# EAGLE schematic OmniMotiv-v1 (EAGLE 5.10)
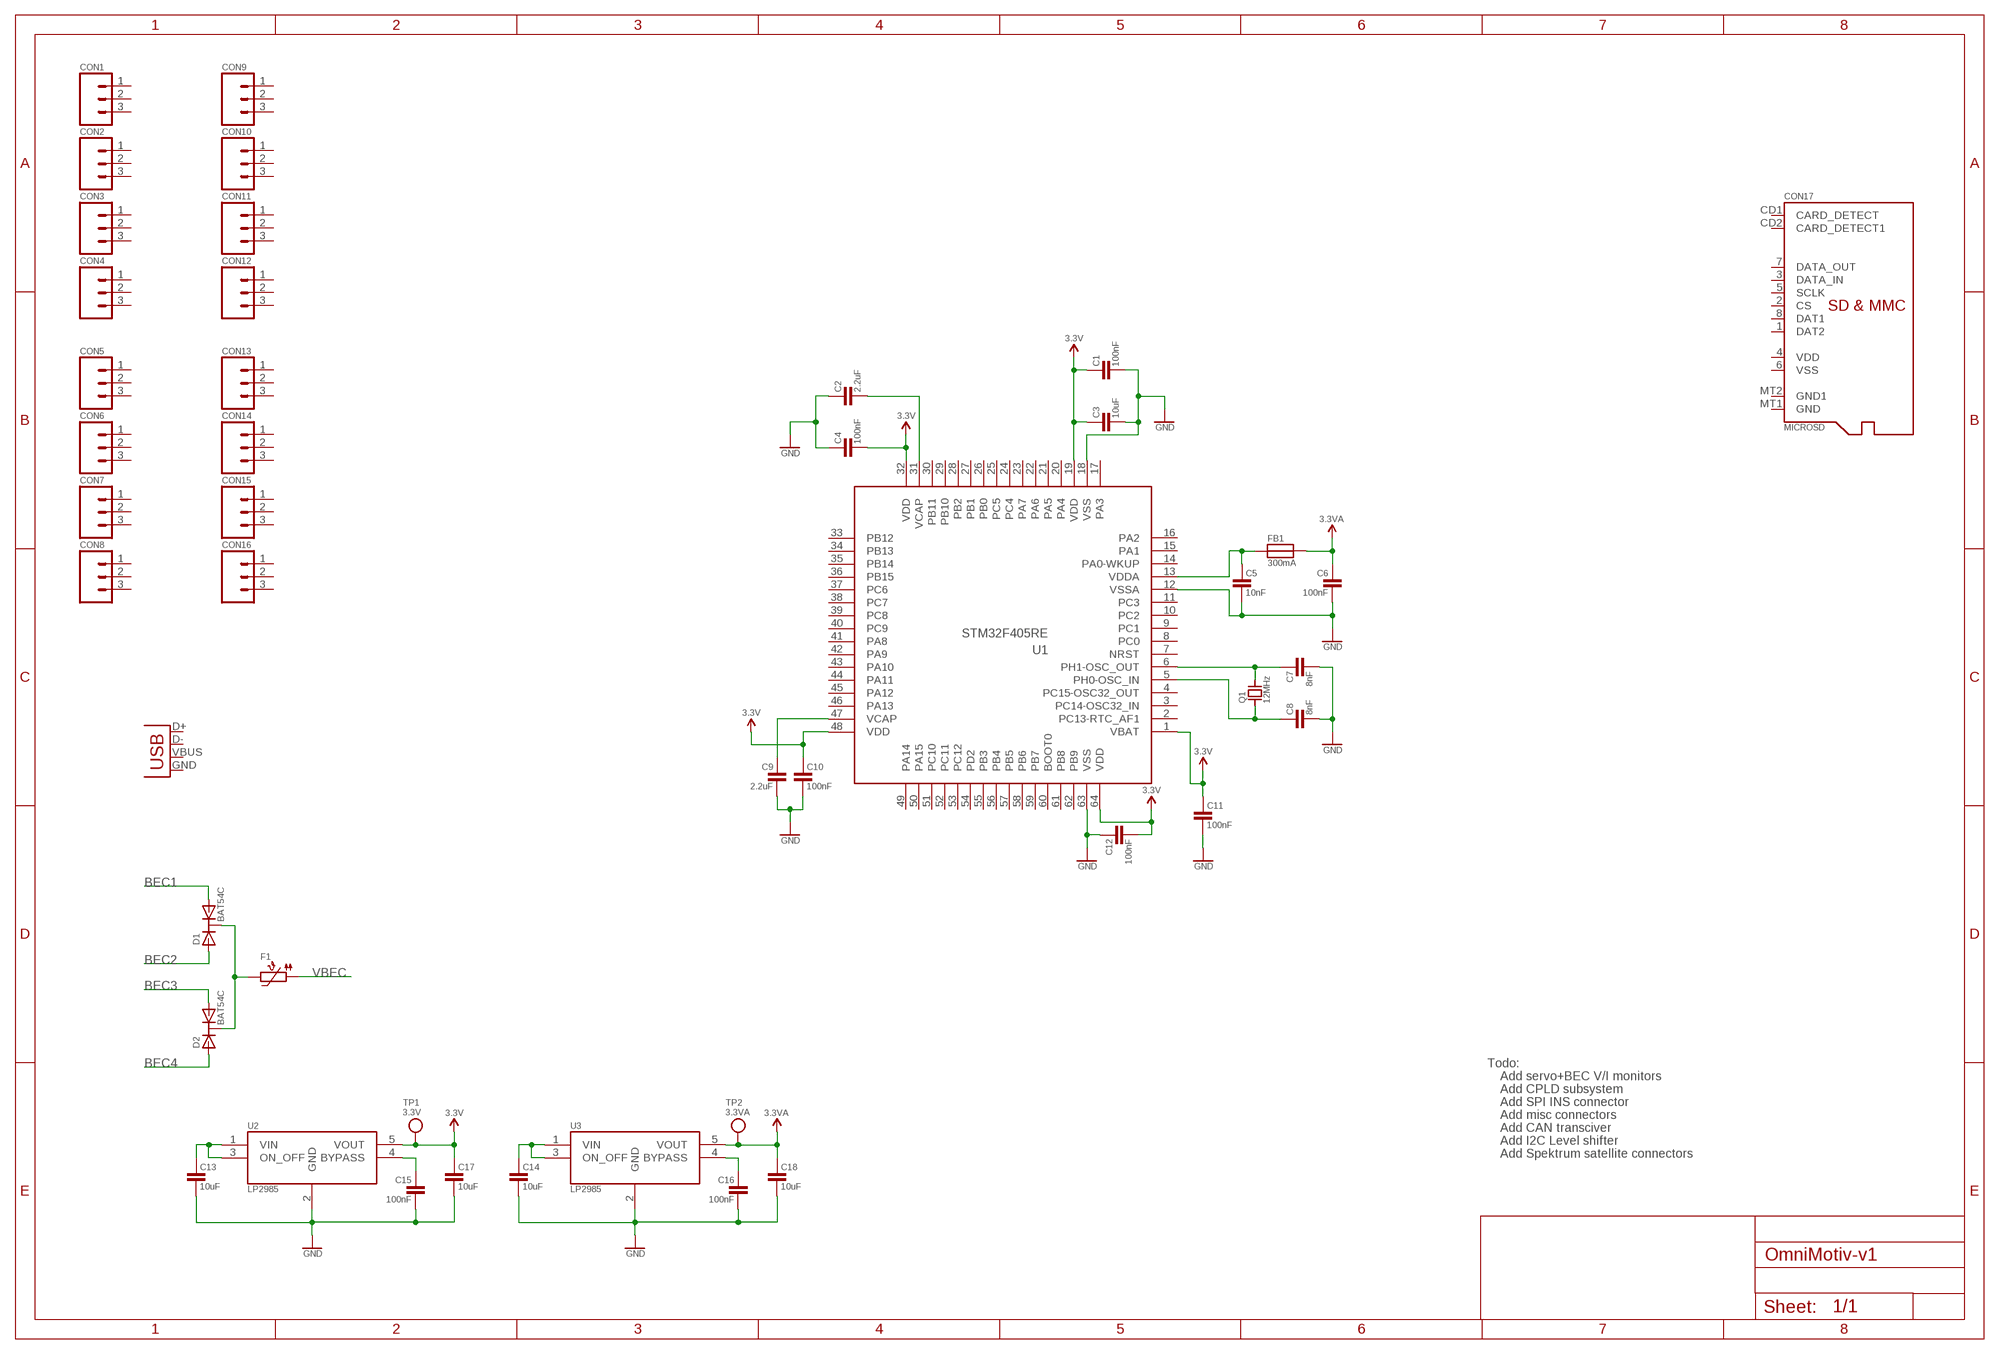
[diagram p0: schematic, sheet 1]

## Parts
C1  100nF  CAPACITOR-CERAMIC0402  [0402-CAP]
C2  2.2uF  CAPACITOR-CERAMIC0603  [0603]
C3  10uF  CAPACITOR-CERAMIC0805  [0805]
C4  100nF  CAPACITOR-CERAMIC0402  [0402-CAP]
C5  10nF  CAPACITOR-CERAMIC0402  [0402-CAP]
C6  100nF  CAPACITOR-CERAMIC0402  [0402-CAP]
C7  8nF  CAPACITOR-CERAMIC0402  [0402-CAP]
C8  8nF  CAPACITOR-CERAMIC0402  [0402-CAP]
C9  2.2uF  CAPACITOR-CERAMIC0603  [0603]
C10  100nF  CAPACITOR-CERAMIC0402  [0402-CAP]
C11  100nF  CAPACITOR-CERAMIC0402  [0402-CAP]
C12  100nF  CAPACITOR-CERAMIC0402  [0402-CAP]
C13  10uF  CAPACITOR-CERAMIC0805  [0805]
C14  10uF  CAPACITOR-CERAMIC0805  [0805]
C15  100nF  CAPACITOR-CERAMIC0402  [0402-CAP]
C16  100nF  CAPACITOR-CERAMIC0402  [0402-CAP]
C17  10uF  CAPACITOR-CERAMIC0805  [0805]
C18  10uF  CAPACITOR-CERAMIC0805  [0805]
CON1  M03PTH  [1X03]
CON2  M03PTH  [1X03]
CON3  M03PTH  [1X03]
CON4  M03PTH  [1X03]
CON5  M03PTH  [1X03]
CON6  M03PTH  [1X03]
CON7  M03PTH  [1X03]
CON8  M03PTH  [1X03]
CON9  M03PTH  [1X03]
CON10  M03PTH  [1X03]
CON11  M03PTH  [1X03]
CON12  M03PTH  [1X03]
CON13  M03PTH  [1X03]
CON14  M03PTH  [1X03]
CON15  M03PTH  [1X03]
CON16  M03PTH  [1X03]
CON17  MICROSD  [MICROSD]
D1  BAT54C  [SOT23]
D2  BAT54C  [SOT23]
F1  PTC1812  [1812]
FB1  300mA  FERRITE0603  [0603]
Q1  12MHz  CRYSTAL5X3-2  [CRYSTAL-5X3-2]
TP1  3.3V  TESTPOINTROUND1MM  [TESTPOINT_ROUND_1MM]
TP2  3.3VA  TESTPOINTROUND1MM  [TESTPOINT_ROUND_1MM]
U1  STM32F405RE  STM32F205RE  [LQFP64]
U2  LP2985  [SOT-23-5]
U3  LP2985  [SOT-23-5]
USB1  USBMICRO-B  [USB-MICRO-B]

## Nets
3.3V: C1.1 C3.1 C4.2 C10.1 C11.1 C12.2 C17.1 TP1.1 U1.1(VBAT) U1.19(VDD) U1.32(VDD) U1.48(VDD) U1.64(VDD) U2.5(VOUT)
3.3VA: C6.1 C18.1 FB1.2 TP2.1 U3.5(VOUT)
BEC1: D1.2
BEC2: D1.1
BEC3: D2.2
BEC4: D2.1
GND: C1.2 C2.1 C3.2 C4.1 C5.2 C6.2 C7.2 C8.2 C9.2 C10.2 C11.2 C12.1 C13.2 C14.2 C15.2 C16.2 C17.2 C18.2 U1.12(VSSA) U1.18(VSS) U1.63(VSS) U2.2(GND) U3.2(GND)
N$1: C5.1 FB1.1 U1.13(VDDA)
N$2: C7.1 Q1.2 U1.6(PH1-OSC_OUT)
N$3: C8.1 Q1.1 U1.5(PH0-OSC_IN)
N$4: C13.1 U2.1(VIN) U2.3(ON_OFF)
N$5: C14.1 U3.1(VIN) U3.3(ON_OFF)
N$6: C15.1 U2.4(BYPASS)
N$7: D1.3 D2.3 F1.1
N$8: C16.1 U3.4(BYPASS)
VBEC: F1.2
VCAP: C9.1 U1.47(VCAP)
VCAP2: C2.2 U1.31(VCAP)
Unconnected: CON1.1 CON1.2 CON1.3 CON2.1 CON2.2 CON2.3 CON3.1 CON3.2 CON3.3 CON4.1 CON4.2 CON4.3 CON5.1 CON5.2 CON5.3 CON6.1 CON6.2 CON6.3 CON7.1 CON7.2 CON7.3 CON8.1 CON8.2 CON8.3 CON9.1 CON9.2 CON9.3 CON10.1 CON10.2 CON10.3 CON11.1 CON11.2 CON11.3 CON12.1 CON12.2 CON12.3 CON13.1 CON13.2 CON13.3 CON14.1 CON14.2 CON14.3 CON15.1 CON15.2 CON15.3 CON16.1 CON16.2 CON16.3 CON17.1(DAT2) CON17.2(CS) CON17.3(DATA_IN) CON17.4(VDD) CON17.5(SCLK) CON17.6(VSS) CON17.7(DATA_OUT) CON17.8(DAT1) CON17.CD1(CARD_DETECT) CON17.CD2(CARD_DETECT1) CON17.MT1(GND) CON17.MT2(GND1) U1.2(PC13-RTC_AF1) U1.3(PC14-OSC32_IN) U1.4(PC15-OSC32_OUT) U1.7(NRST) U1.8(PC0) U1.9(PC1) U1.10(PC2) U1.11(PC3) U1.14(PA0-WKUP) U1.15(PA1) U1.16(PA2) U1.17(PA3) U1.20(PA4) U1.21(PA5) U1.22(PA6) U1.23(PA7) U1.24(PC4) U1.25(PC5) U1.26(PB0) U1.27(PB1) U1.28(PB2) U1.29(PB10) U1.30(PB11) U1.33(PB12) U1.34(PB13) U1.35(PB14) U1.36(PB15) U1.37(PC6) U1.38(PC7) U1.39(PC8) U1.40(PC9) U1.41(PA8) U1.42(PA9) U1.43(PA10) U1.44(PA11) U1.45(PA12) U1.46(PA13) U1.49(PA14) U1.50(PA15) U1.51(PC10) U1.52(PC11) U1.53(PC12) U1.54(PD2) U1.55(PB3) U1.56(PB4) U1.57(PB5) U1.58(PB6) U1.59(PB7) U1.60(BOOT0) U1.61(PB8) U1.62(PB9) USB1.D+ USB1.D- USB1.GND USB1.VBUS

## Notes on the sheet
- Todo:
- Add servo+BEC V/I monitors
- Add CPLD subsystem
- Add SPI INS connector
- Add misc connectors
- Add CAN transciver
- Add I2C Level shifter
- Add Spektrum satellite connectors

## Library data of the parts
C1-C18 = OmniLoco:CAPACITOR-CERAMIC: Ceramic Capacitors 0402 - 0402 Surface Mount Capacitors 18pF 50V 5% [Digikey: 587-1950-1-ND] 10nF 6.3V 10% [Digikey: 311-1349-1-ND] 0.1uF 10V 10% [Digikey: 587-1227-1-ND] 0.1uF 16V 10% [Digikey: 587-1451-1-ND] 0.22uF 6.3V 10% [Digikey: 587-1229-1-ND] 0603 - 0603 Surface Mount Capacitors 2.2uF 6.3V 10% [Digikey: 587-1254-1-ND] 2.2uF 10V 10% [Digikey: 587-1253-1-ND] 4.7uF 6.3V 10% [Digikey: 587-1785-1-ND] 0805 - 0805 Surface Mount Capacitors 10uF 16V 10% [Digikey: 587-1295-1-ND]
CON1-CON16 = OmniLoco:M03: Three Way Connector PTH - Standard 0.1" through-hole footprint.
CON17 = OmniLoco:MICROSD: MicroSD/Transflash Card Holder with SPI pinout Molex Push-Pull Type Micro SD Card Socket - 0473340001 [Digikey: WM3288CT-ND] Push-Pull Type Micro SD Card Socket - 15882 [4UConnector: 19656]
D1 D2 = OmniLoco:BAT54C: BAT54C Schottky Diodes (Common Cathode) Vf: 800mV, 30V 200mA - BAT543C [Digikey: BAT54CFSCT-ND] Vf: 900mV, 40V 300mA - BAT54CFILM [Digikey: 497-3786-2-ND]
F1 = OmniLoco:PTC: PTC (Resettable Fuse) 1812 Package 200mA PTC (30V Max, Time-to-Trip: 0.02s) - Digikey: 507-1496-1-ND 750mA PTC (24V Max, Time-to-Trip: 0.2s) - Digikey: MF-MSMF075/24-2CT-ND
FB1 = OmniLoco:FERRITE: Ferrite Bead 0603 HZ0603B102R-10 - 1K Ohm, 200mA [Digikey: 240-2378-1-ND] 742792664 - 1K Ohm, 300mA [Digikey: 732-1586-1-ND]
Q1 = OmniLoco:CRYSTAL: Crystals 5x3.2MM 2SMD - Surface Mount Crystal 12.0MHz 8pF +/-30ppm [Digikey: 644-1034-1-ND] 5x3.2MM 4SMD - Surface Mount Crystal 8.0MHz 18pF +/-50ppm [Digikey: 535-9720-1-ND]
TP1 TP2 = OmniLoco:TESTPOINT: Testpoint Footprints for testpoints, commonly used for debugging or connection points for pogopins. POGOPIN1MM - Throughhole footprint for 1mm pogopins. ROUND1MM - Smallest testpoint, for use with pogopins. ROUND1.5MM - Larger testpoint, more suited to handheld probing.
U1 = OmniLoco:STM32F205
U2 U3 = OmniLoco:LP2985: LP2985 - Low Dropout Linear Regulator 3.3V 150mA - LP2985-33DBVR [Digikey: 296-18476-1-ND]
USB1 = OmniLoco:USB: USB Connectors Micro USB - ZX62-B-5PA(11) [Digikey: H11634CT-ND]